# EAGLE design ControladorPID (EAGLE 9.4.2)
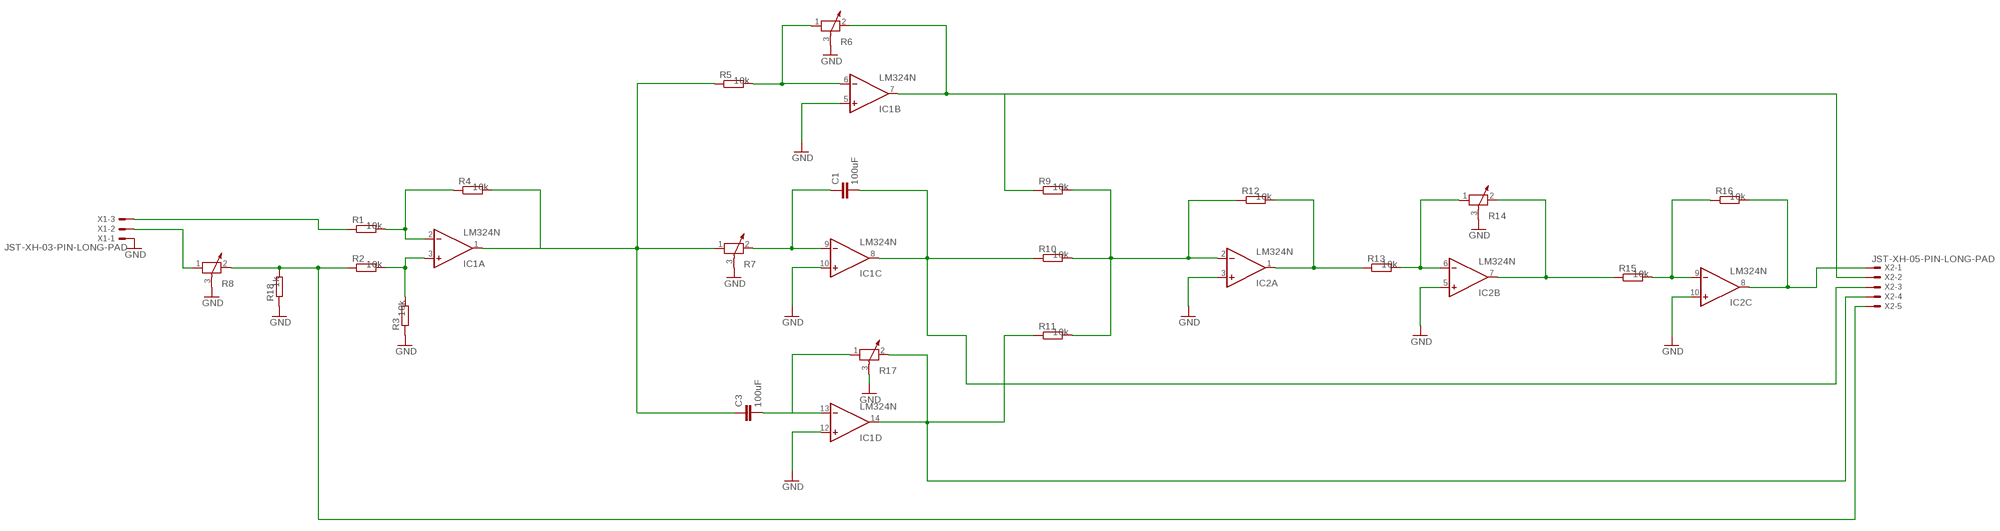
[diagram p0: schematic, sheet 1]

## Parts
C1  100uF  C2,5-3  [C2.5-3]
C3  100uF  C2,5-3  [C2.5-3]
IC1  LM324N  [DIL14]
IC2  LM324N  [DIL14]
R1  R-EU_M1206  [M1206]
R2  R-EU_M1206  [M1206]
R3  R-EU_M1206  [M1206]
R4  R-EU_M1206  [M1206]
R5  R-EU_M1206  [M1206]
R6  POTENTIOMETER_PT-10  [PT-10]
R7  POTENTIOMETER_PT-10  [PT-10]
R8  POTENTIOMETER_PT-10  [PT-10]
R9  R-EU_M1206  [M1206]
R10  R-EU_M1206  [M1206]
R11  R-EU_M1206  [M1206]
R12  R-EU_M1206  [M1206]
R13  R-EU_M1206  [M1206]
R14  POTENTIOMETER_PT-10  [PT-10]
R15  R-EU_M1206  [M1206]
R16  R-EU_M1206  [M1206]
R17  POTENTIOMETER_PT-10  [PT-10]
R18  R-EU_M1206  [M1206]
X1  JST-XH-03-PIN-LONG-PAD  [JST-XH-03-PACKAGE-LONG-PAD]
X2  JST-XH-05-PIN-LONG-PAD  [JST-XH-05-PACKAGE-LONG-PAD]

## Nets
GND: IC1.5(B:+IN) IC1.10(C:+IN) IC1.12(D:+IN) IC2.3(A:+IN) IC2.5(B:+IN) IC2.10(C:+IN) R3.1 R6.3 R7.3 R8.3 R14.3 R17.3 R18.1 X1.1
N$1: IC1.2(A:-IN) R1.2 R4.1
N$2: IC1.3(A:+IN) R2.2 R3.2
N$3: C3.1 IC1.1(A:OUT) R4.2 R5.1 R7.1
N$4: C1.2 IC1.8(C:OUT) R10.1 X2.3
N$5: IC1.6(B:-IN) R5.2 R6.1
N$6: R1.1 X1.3
N$7: C1.1 IC1.9(C:-IN) R7.2
N$8: C3.2 IC1.13(D:-IN)
N$10: IC1.14(D:OUT) R11.1 R17.2 X2.4
N$11: R17.1
N$12: IC2.6(B:-IN) R13.2 R14.1
N$13: IC2.2(A:-IN) R9.2 R10.2 R11.2 R12.1
N$14: IC2.1(A:OUT) R12.2 R13.1
N$15: IC2.7(B:OUT) R14.2 R15.1
N$16: IC2.9(C:-IN) R15.2 R16.1
N$17: IC2.8(C:OUT) R16.2 X2.1
N$18: R2.1 R8.2 R18.2 X2.5
N$19: R8.1 X1.2
N$20: IC1.7(B:OUT) R6.2 R9.1 X2.2
Unconnected: IC2.12(D:+IN) IC2.13(D:-IN) IC2.14(D:OUT)

## Power pins joined to a net without a drawn wire
V+: IC1.4(P:V+) IC2.4(P:V+)
V-: IC1.11(P:V-) IC2.11(P:V-)

## Library data of the parts
C1 C3 = capacitor-wima:C: CAPACITOR naming: grid - package width
IC1 IC2 = linear4:LM324: OP AMP
R1-R5 R9-R13 R15 R16 = rcl:R-EU_: RESISTOR, European symbol; SPICEPREFIX: 10k
R6-R8 R14 R17 = rcl:POTENTIOMETER_: Potentiometer; SPICEMODEL: POT; SPICEPREFIX: X
R18 = rcl:R-EU_: RESISTOR, European symbol; SPICEPREFIX: 1k
X1 = Rembrandt Electronics - JST XH Connectors v1-0:JST-XH-03-PIN: JST XH Connector 2 Pin Wire to board connector. Pitch: 2,54 mm, (0.100") Number of pins: 3 Created by Rembrandt Electronics www.rembrandtelectronics.com
X2 = Rembrandt Electronics - JST XH Connectors v1-0:JST-XH-05-PIN: JST XH Connector 2 Pin Wire to board connector. Pitch: 2,54 mm, (0.100") Number of pins: 5 Created by Rembrandt Electronics www.rembrandtelectronics.com

## Board
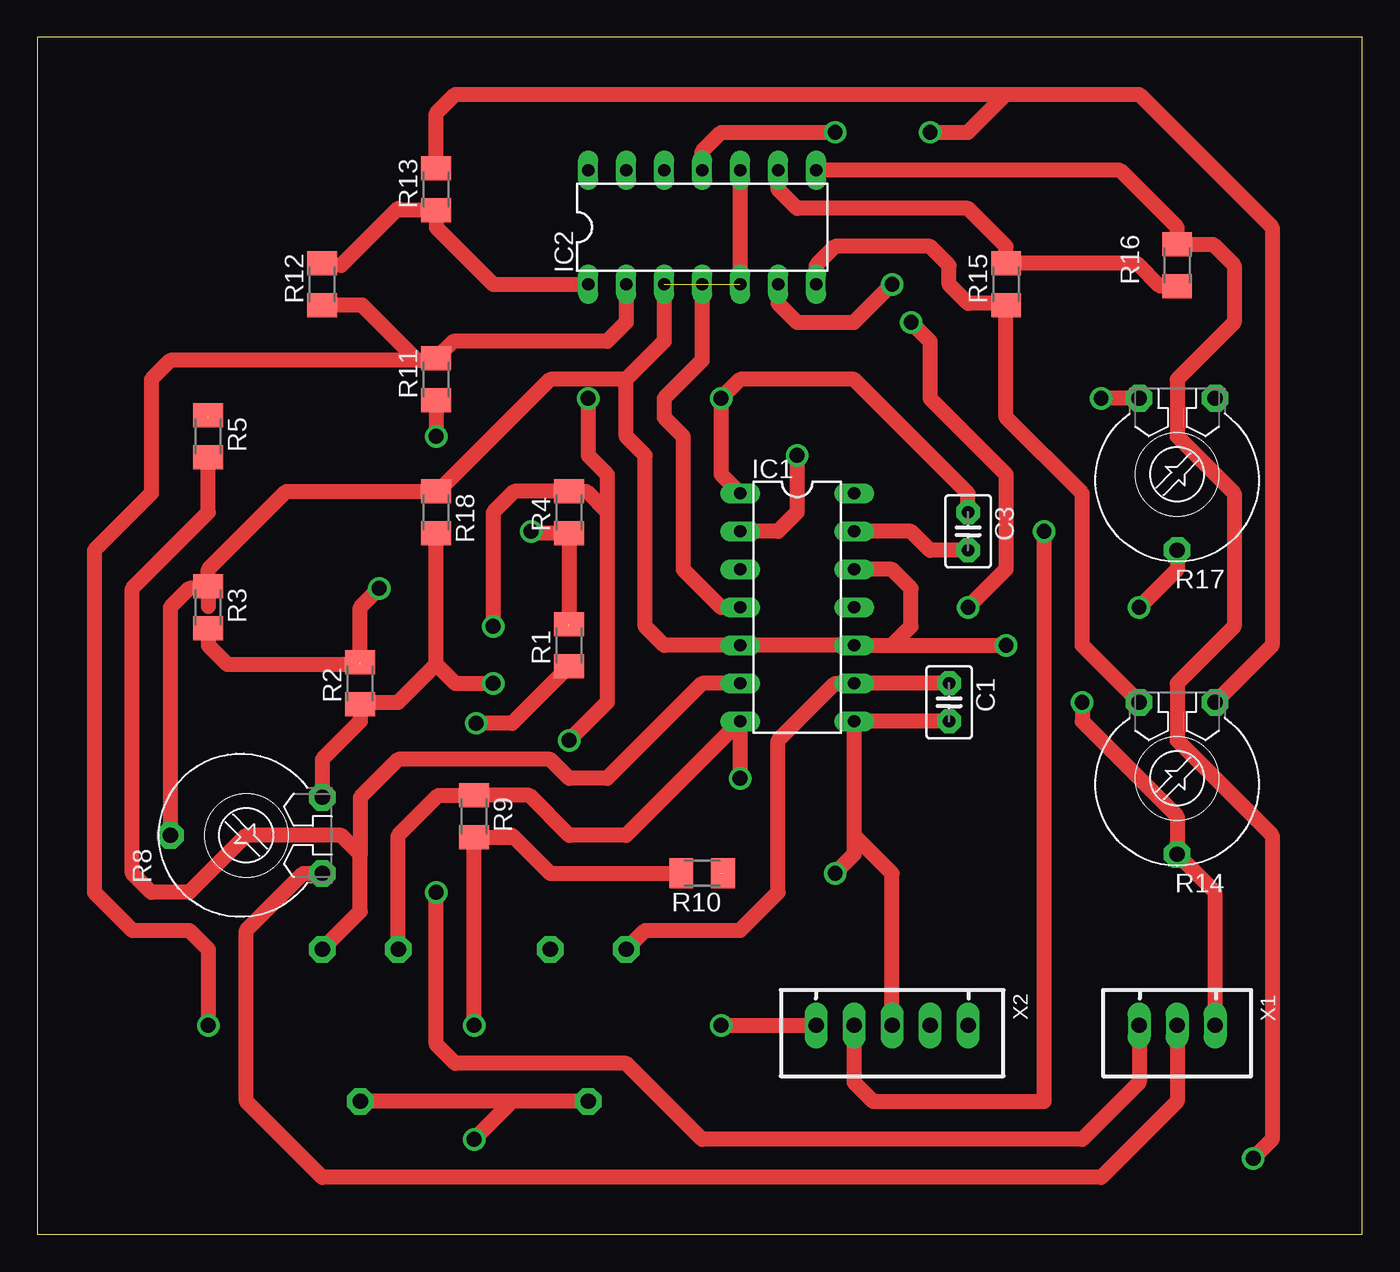
[diagram p1: board, top side]
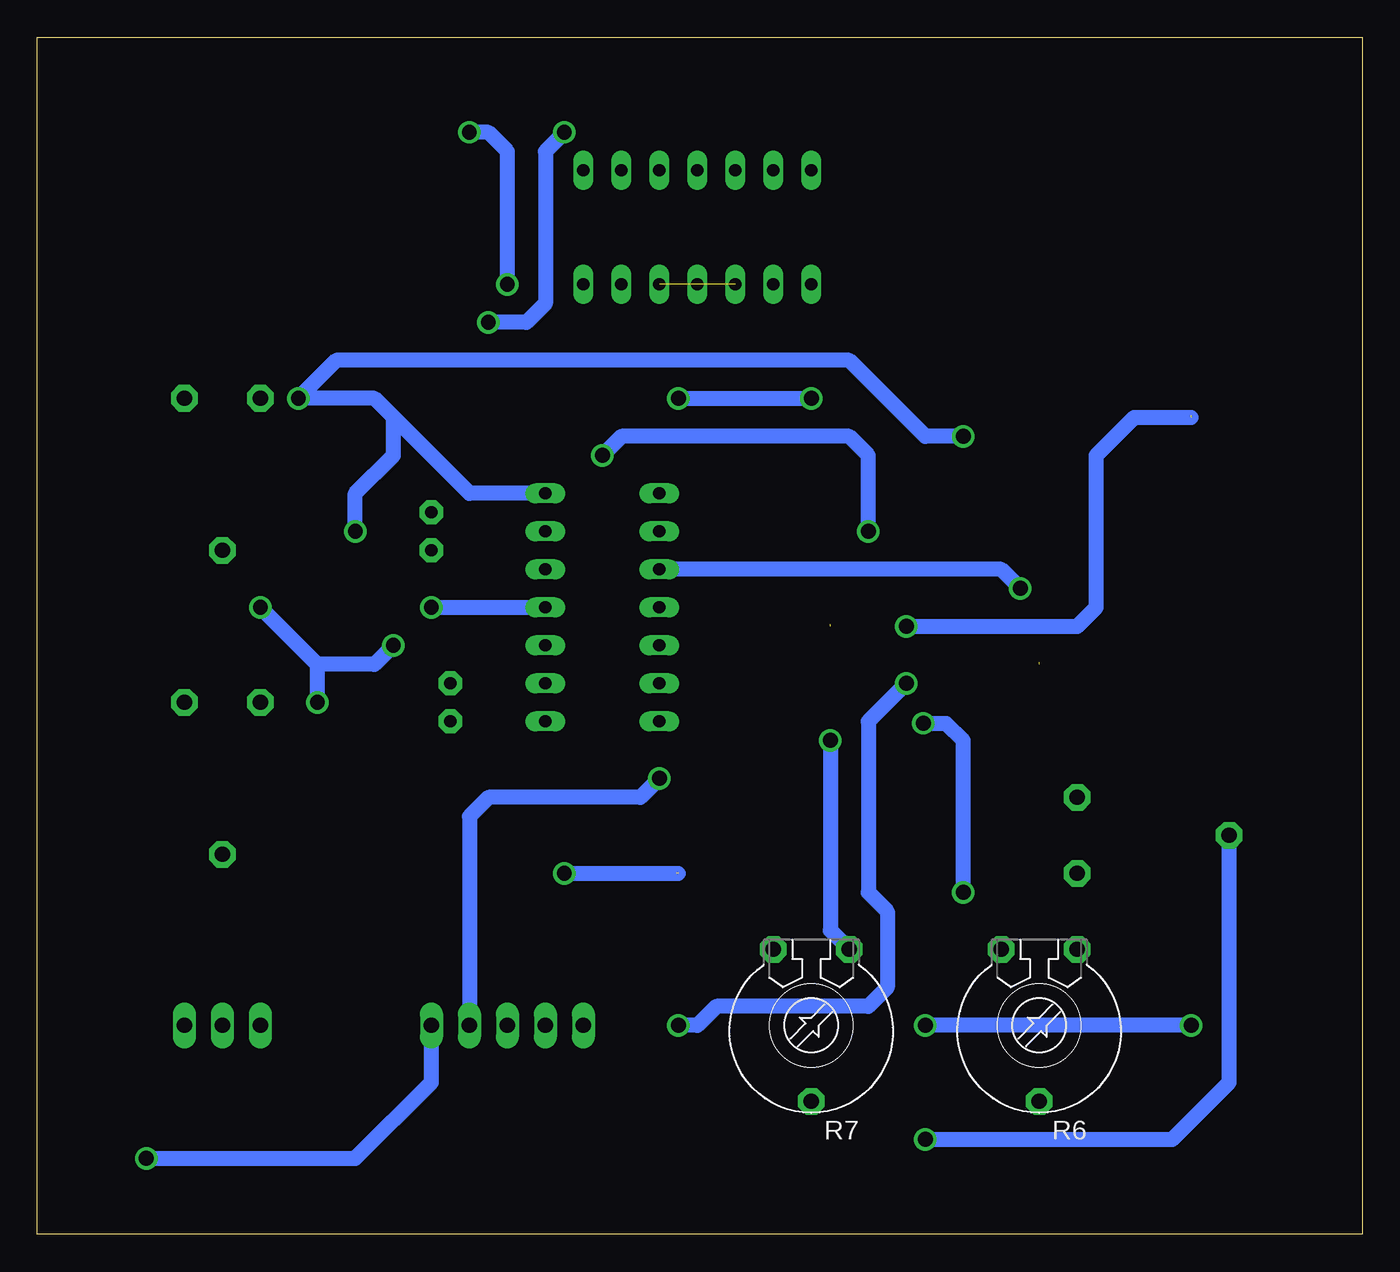
[diagram p2: board, bottom side, seen from below]

Size 88.57 x 80 mm. Coordinates in mm from the lower left corner, seen from the top.
Outline: 0,0 88.57,0 88.57,80 0,80 0,0
Copper layers (1*16): Top 0.035mm / dielectric 1.5mm / Bottom 0.035mm
Design rules "default": minimum track width 6mil, minimum drill 0.35mm, track to track 6mil, track to pad 6mil, pad to pad 6mil, via to via 6mil, smd to smd 6mil, copper to edge 40mil, drill to drill 6mil, minimum pad ring 10mil, minimum via ring 8mil, stop-mask expansion 4mil, vias tented up to drill 0mil, thermal gap 10mil

### Footprints (pad centres in the part's own frame; a part is rotated, then mirrored left to right if it is on the bottom)
C2.5-3 = drill 0.813 pad 1.6 octagon: 1 -1.27,0; 2 1.27,0
DIL14 = drill 0.813 long: 1 -7.62,-3.81; 2 -5.08,-3.81; 3 -2.54,-3.81; 4 0,-3.81; 5 2.54,-3.81; 6 5.08,-3.81; 7 7.62,-3.81; 8 7.62,3.81; 9 5.08,3.81; 10 2.54,3.81; 11 0,3.81; 12 -2.54,3.81; 13 -5.08,3.81; 14 -7.62,3.81
M1206 = smd 1.6 x 2: 1 -1.4,0; 2 1.4,0
PT-10 = drill 1.016 pad 1.778 octagon: 1 -2.54,-5.08; 2 2.54,-5.08; 3 0,5.08
JST-XH-03-PACKAGE-LONG-PAD = drill 1.016 long: 1 -2.54,0; 2 0,0; 3 2.54,0
JST-XH-05-PACKAGE-LONG-PAD = drill 1.016 long: 1 -5.08,0; 2 -2.54,0; 3 0,0; 4 2.54,0; 5 5.08,0

### Placement (x,y rotation side)
C1  60.96,35.56 270 top
C3  62.23,46.99 270 top
IC1  50.8,41.91 270 top
IC2  44.45,67.31 0 top
R1  35.56,39.37 90 top
R2  21.59,36.83 90 top
R3  11.43,41.91 270 top
R4  35.56,48.26 90 top
R5  11.43,53.34 270 top
R6  21.59,13.97 180 bottom
R7  36.83,13.97 180 bottom
R8  13.97,26.67 90 top
R9  29.21,27.94 270 top
R10  44.45,24.13 180 top
R11  26.67,57.15 90 top
R12  19.05,63.5 90 top
R13  26.67,69.85 90 top
R14  76.2,30.48 180 top
R15  64.77,63.5 90 top
R16  76.2,64.77 90 top
R17  76.2,50.8 180 top
R18  26.67,48.26 270 top
X1  76.2,13.97 180 top
X2  57.15,13.97 180 top

### Tracks (layer width: path | path; a pad name or v marks a point on that pad's centre or on a via)
GND  (via drill 1 pad 1)  (1 unrouted)
  Top 1.016: R7.3 31.75,8.89 | 31.75,8.89 R6.3 | X1.1 78.74,22.86 R14.3 76.2,27.94 69.85,34.29 v69.85,35.56 | R17.3 76.2,44.45 v73.66,41.91 | R3.1 11.43,41.97 | R3.1 11.3,43.18 10.16,43.18 8.89,41.91 R8.3 | IC2.3 41.91,59.69 40.64,58.42 39.37,57.15 | 39.37,57.15 34.29,57.15 26.8,49.66 R18.1 16.64,49.66 11.43,44.45 R3.1 | 57.15,39.37 IC1.10 IC1.5 41.91,39.37 40.64,40.64 40.64,52.07 39.37,53.34 39.37,57.15 | 57.15,39.37 58.42,40.64 58.42,43.18 57.15,44.45 IC1.12 | 57.15,39.37 v64.77,39.37 | 31.75,8.89 v29.21,6.35 | IC2.10 IC2.5
  Bottom 1.016: v73.66,41.91 69.85,38.1 | 69.85,38.1 v69.85,35.56 | v64.77,39.37 66.04,38.1 69.85,38.1 | v29.21,6.35 12.7,6.35 8.89,10.16 R8.3
N$1  (via drill 1 pad 1)  (1 unrouted)
  Top 1.016: 35.56,40.64 R4.1 33.15,46.86 v33.02,46.99 | v50.8,52.07 50.8,48.26 49.53,46.99 IC1.2
  Bottom 1.016: v33.02,46.99 33.02,52.07 34.29,53.34 49.53,53.34 v50.8,52.07
N$2  (via drill 1 pad 1)  (1 unrouted)
  Top 1.016: R3.2 11.43,39.37 12.7,38.1 21.59,38.1 21.59,41.91 v22.86,43.18
  Bottom 1.016: v22.86,43.18 24.13,44.45 IC1.3
N$3  (via drill 1 pad 1)  (1 unrouted)
  Top 1.016: C3.1 62.23,49.53 54.61,57.15 46.99,57.15 v45.72,55.88 45.72,50.8 IC1.1 | v30.48,40.64 30.48,48.26 31.88,49.66 R4.2 36.7,49.66 38.1,48.26 | 38.1,48.26 38.1,35.56 v35.56,33.02 | v36.83,55.88 36.83,52.07 38.1,50.8 38.1,48.26
  Bottom 1.016: v30.48,40.64 19.05,40.64 17.78,41.91 17.78,52.07 15.24,54.61 11.43,54.61 | v35.56,33.02 35.56,20.32 R7.1 | v45.72,55.88 v36.83,55.88
N$4  (via drill 1 pad 1)  (1 unrouted)
  Top 1.016: C1.2 IC1.8 54.61,26.67 | 54.61,26.67 54.61,25.4 v53.34,24.13 | X2.3 57.15,24.13 54.61,26.67
  Bottom 1.016: v53.34,24.13 45.72,24.13
N$5
  Top 1.016: R6.1 21.59,21.59 21.59,25.4 | 21.59,25.4 20.32,26.67 13.97,26.67 10.16,22.86 7.62,22.86 6.35,24.13 6.35,43.18 11.43,48.26 R5.2 | IC1.6 44.45,36.83 38.1,30.48 35.56,30.48 34.29,31.75 24.13,31.75 21.59,29.21 21.59,25.4
N$6  (via drill 1 pad 1)
  Top 1.016: X1.3 73.66,10.16 69.85,6.35 44.45,6.35 39.37,11.43 27.94,11.43 26.67,12.7 v26.67,22.86 | v29.34,34.16 31.75,34.16 R1.1
  Bottom 1.016: v26.67,22.86 26.67,33.02 27.81,34.16 v29.34,34.16
N$7
  Top 1.016: C1.1 IC1.9 53.34,36.83 49.53,33.02 49.53,22.86 46.99,20.32 40.64,20.32 R7.2
N$8
  Top 1.016: C3.2 59.69,45.72 58.42,46.99 IC1.13
N$10  (via drill 1 pad 1)
  Top 1.016: R17.2 v71.12,55.88 | R11.1 v26.67,53.34 | X2.4 54.61,10.16 55.88,8.89 67.31,8.89 v67.31,46.99
  Bottom 1.016: v26.67,53.34 29.21,53.34 34.29,58.42 68.58,58.42 v71.12,55.88 66.04,55.88 64.77,54.61 | 64.77,54.61 59.69,49.53 IC1.14 | v67.31,46.99 67.31,49.53 64.77,52.07 64.77,54.61
N$12  (via drill 1 pad 1)
  Top 1.016: 64.77,76.2 27.94,76.2 26.67,74.93 R13.2 | 64.77,76.2 73.66,76.2 82.55,67.31 82.55,39.37 R14.1 | IC2.6 49.53,62.23 50.8,60.96 54.61,60.96 v57.15,63.5 | 64.77,76.2 62.23,73.66 v59.69,73.66
  Bottom 1.016: v57.15,63.5 57.15,72.39 58.42,73.66 v59.69,73.66
N$13  (via drill 1 pad 1)
  Top 1.016: R10.2 34.29,24.13 31.75,26.67 31.62,26.54 R9.2 v29.21,13.97 | IC2.2 39.37,60.96 38.1,59.69 27.81,59.69 R11.2 26.54,58.42 25.4,58.42 | R12.1 21.72,62.1 25.4,58.42 | 25.4,58.42 8.89,58.42 7.62,57.15 7.62,49.53 3.81,45.72 3.81,22.86 6.35,20.32 10.16,20.32 11.43,19.05 v11.43,13.97
  Bottom 1.016: v11.43,13.97 v29.21,13.97
N$14
  Top 1.016: R12.2 19.18,64.77 20.32,64.77 24.13,68.58 24.26,68.45 R13.1 26.67,67.31 30.48,63.5 IC2.1
N$15
  Top 1.016: IC2.7 52.07,64.77 53.34,66.04 59.69,66.04 60.96,64.77 60.96,63.5 62.23,62.23 64.64,62.23 R15.1 64.77,54.61 69.85,49.53 69.85,39.37 R14.2
N$16
  Top 1.016: IC2.9 49.53,69.85 50.8,68.58 62.23,68.58 64.77,66.04 R15.2 73.53,64.9 75.06,63.37 R16.1
N$17  (via drill 1 pad 1)
  Top 1.016: IC2.8 72.39,71.12 76.2,67.31 R16.2 78.61,66.17 80.01,64.77 80.01,60.96 76.2,57.15 76.2,53.34 80.01,49.53 80.01,40.64 76.2,36.83 76.2,33.02 82.55,26.67 82.55,6.35 v81.28,5.08
  Bottom 1.016: v81.28,5.08 67.31,5.08 62.23,10.16 X2.1
N$18  (via drill 1 pad 1)
  Top 1.016: R8.2 19.05,31.75 21.59,34.29 R2.1 21.72,35.56 24.13,35.56 26.67,38.1 | 26.67,38.1 R18.2 | 26.67,38.1 27.94,36.83 v30.48,36.83 | v45.72,13.97 X2.5
  Bottom 1.016: v30.48,36.83 33.02,34.29 33.02,22.86 31.75,21.59 31.75,16.51 33.02,15.24 43.18,15.24 44.45,13.97 v45.72,13.97
N$19
  Top 1.016: R8.1 17.78,24.13 13.97,20.32 13.97,8.89 19.05,3.81 71.12,3.81 76.2,8.89 X1.2
N$20  (via drill 1 pad 1)
  Top 1.016: R6.2 24.13,26.67 26.8,29.34 R9.1 32.89,29.34 35.56,26.67 39.37,26.67 IC1.7 v46.99,30.48
  Bottom 1.016: v46.99,30.48 48.26,29.21 58.42,29.21 59.69,27.94 X2.2
V+
  Top 1.016: IC1.4 45.72,41.91 43.18,44.45 43.18,53.34 41.91,54.61 41.91,55.88 44.45,58.42 IC2.4
V-  (via drill 1 pad 1)
  Top 1.016: IC2.11 44.45,72.39 45.72,73.66 v53.34,73.66 | v58.42,60.96 59.69,59.69 59.69,55.88 64.77,50.8 64.77,44.45 v62.23,41.91
  Bottom 1.016: v53.34,73.66 54.61,72.39 54.61,62.23 55.88,60.96 v58.42,60.96 | v62.23,41.91 IC1.11